# EasyEDA Pro project PT32S038x-Demo.eprj, schematic DEMOPT32x038x Development Kit 1.0

## Sheets
1 Debug: Create Date: 2023-02-03; Page Name: Debug; Project Name: PT32S038x-Demo; Schematic Name: DEMOPT32x038x Development Kit 1.0; Update Date: 2023-02-23; Company: 嘉立创EDA; Page Size: A3; Version: V1.0
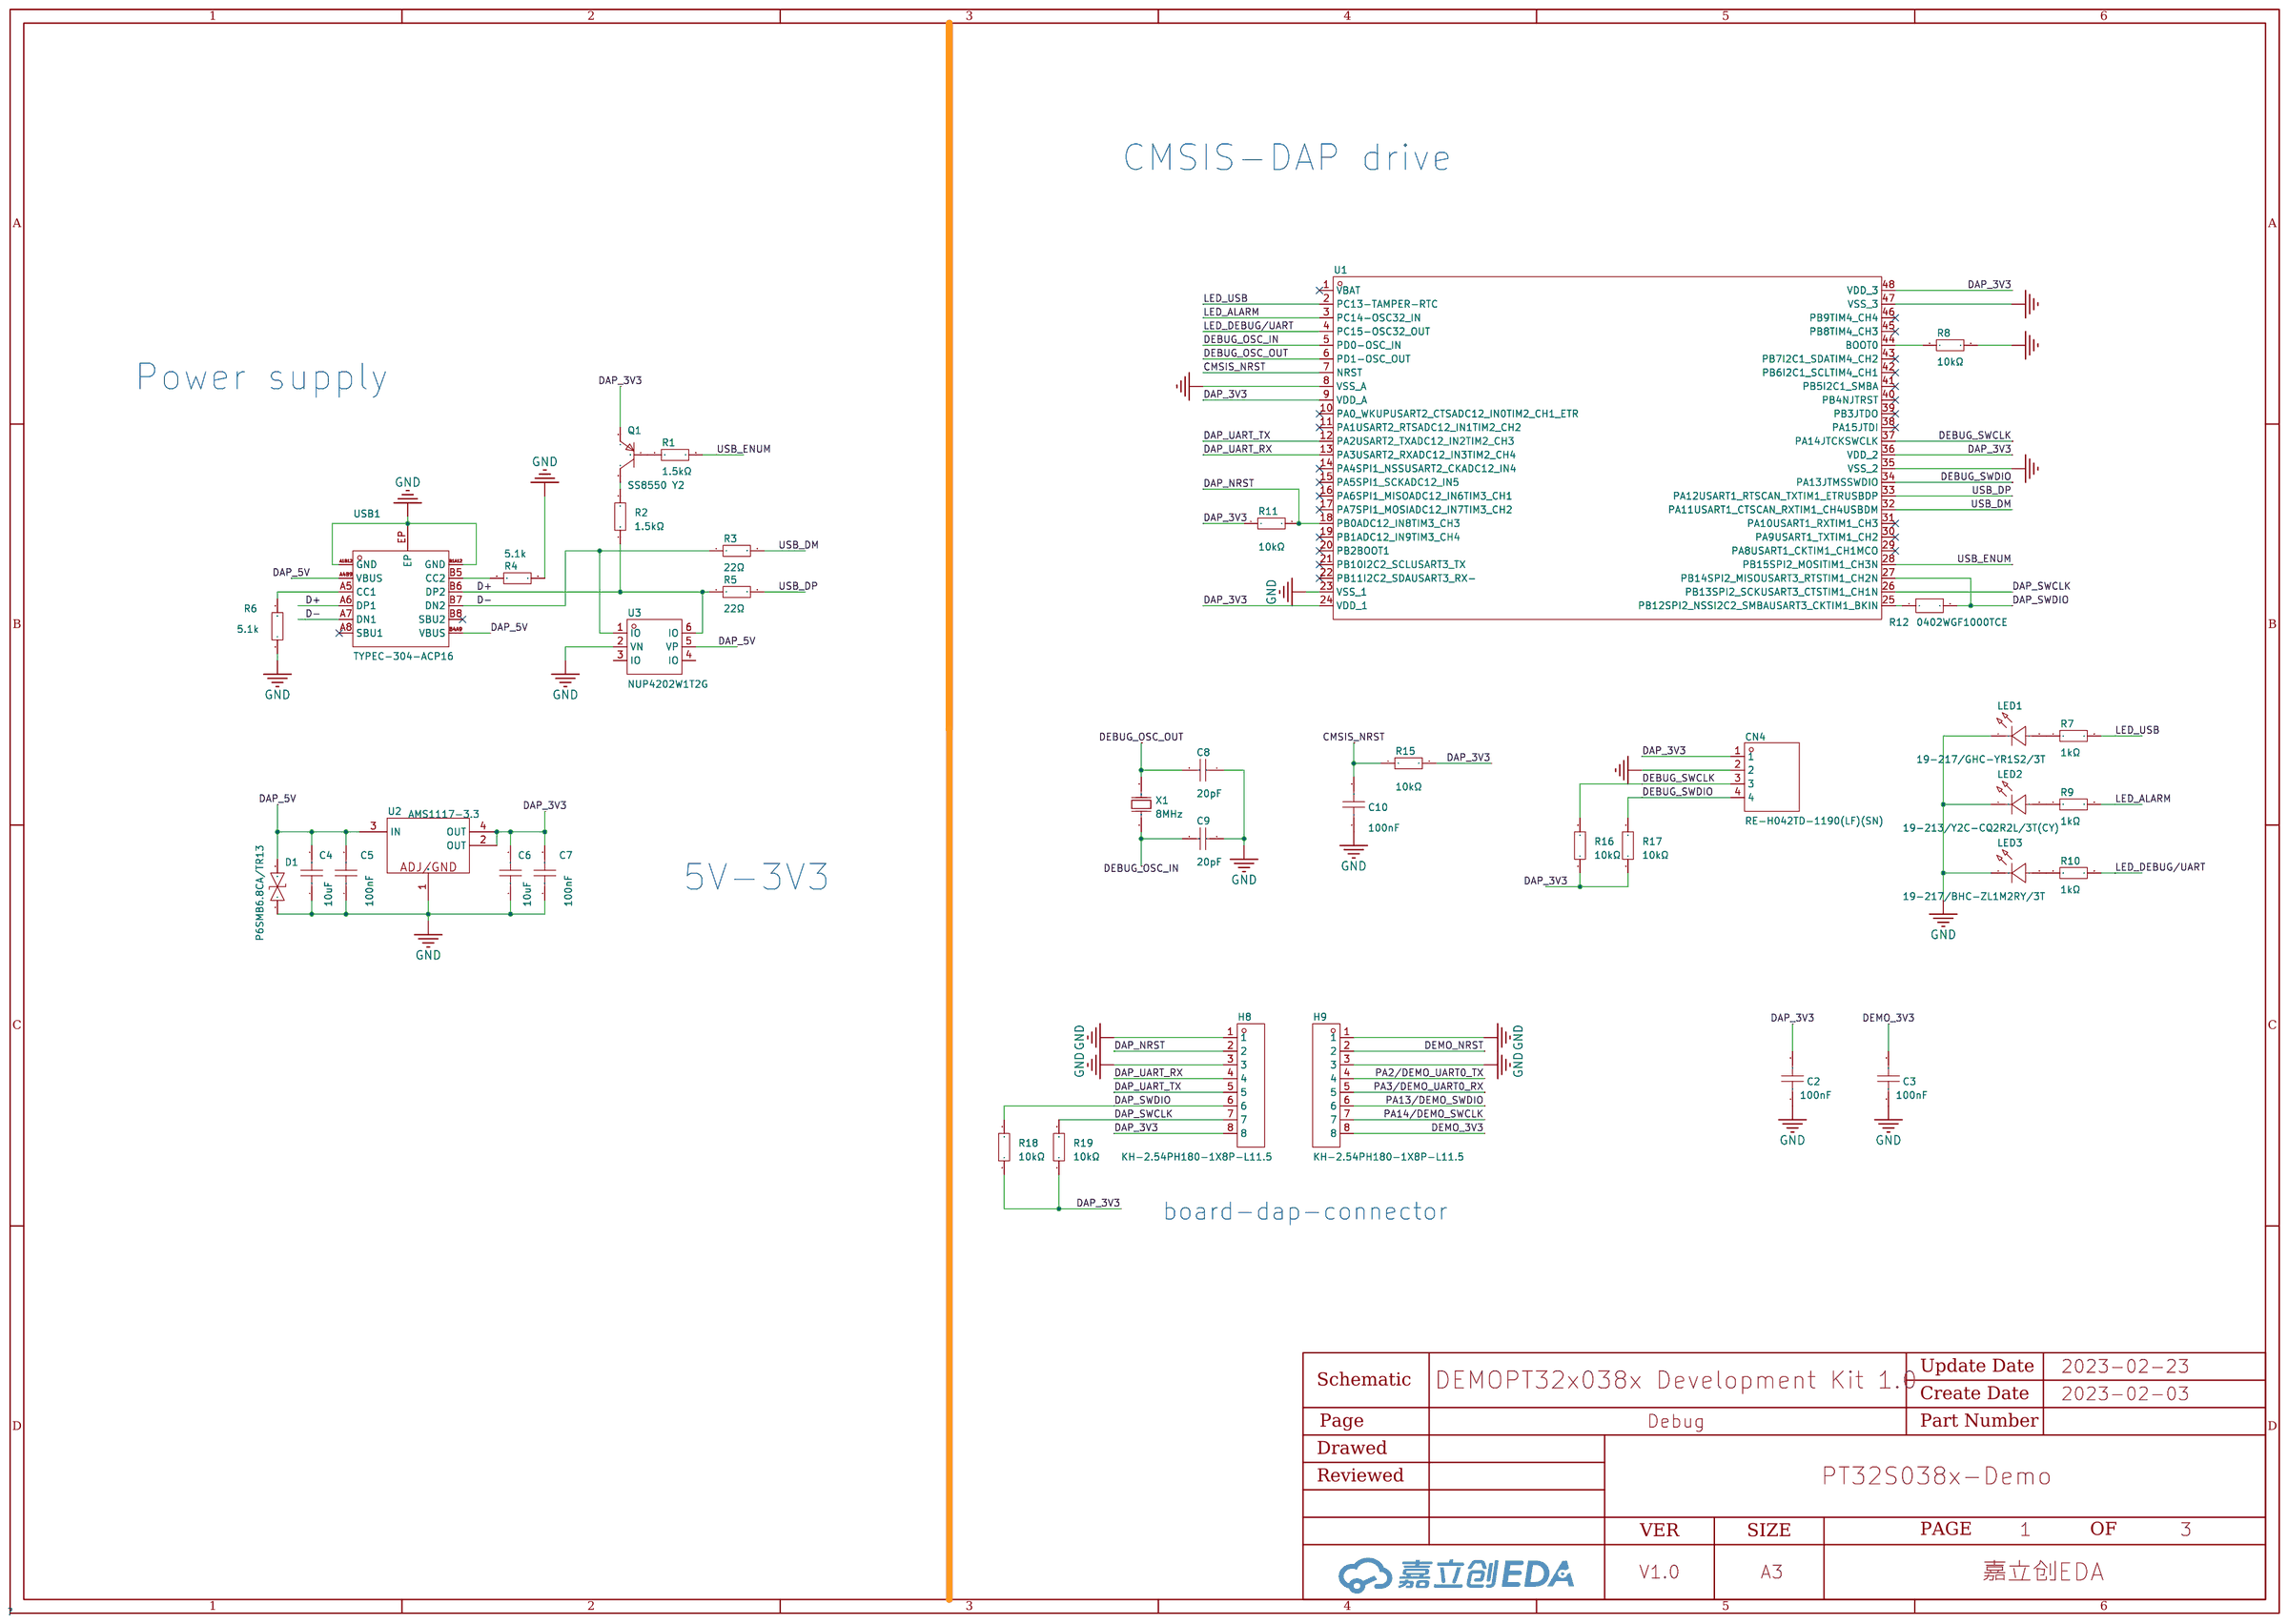
[diagram p0: Debug]
2 MCU: Page Name: MCU
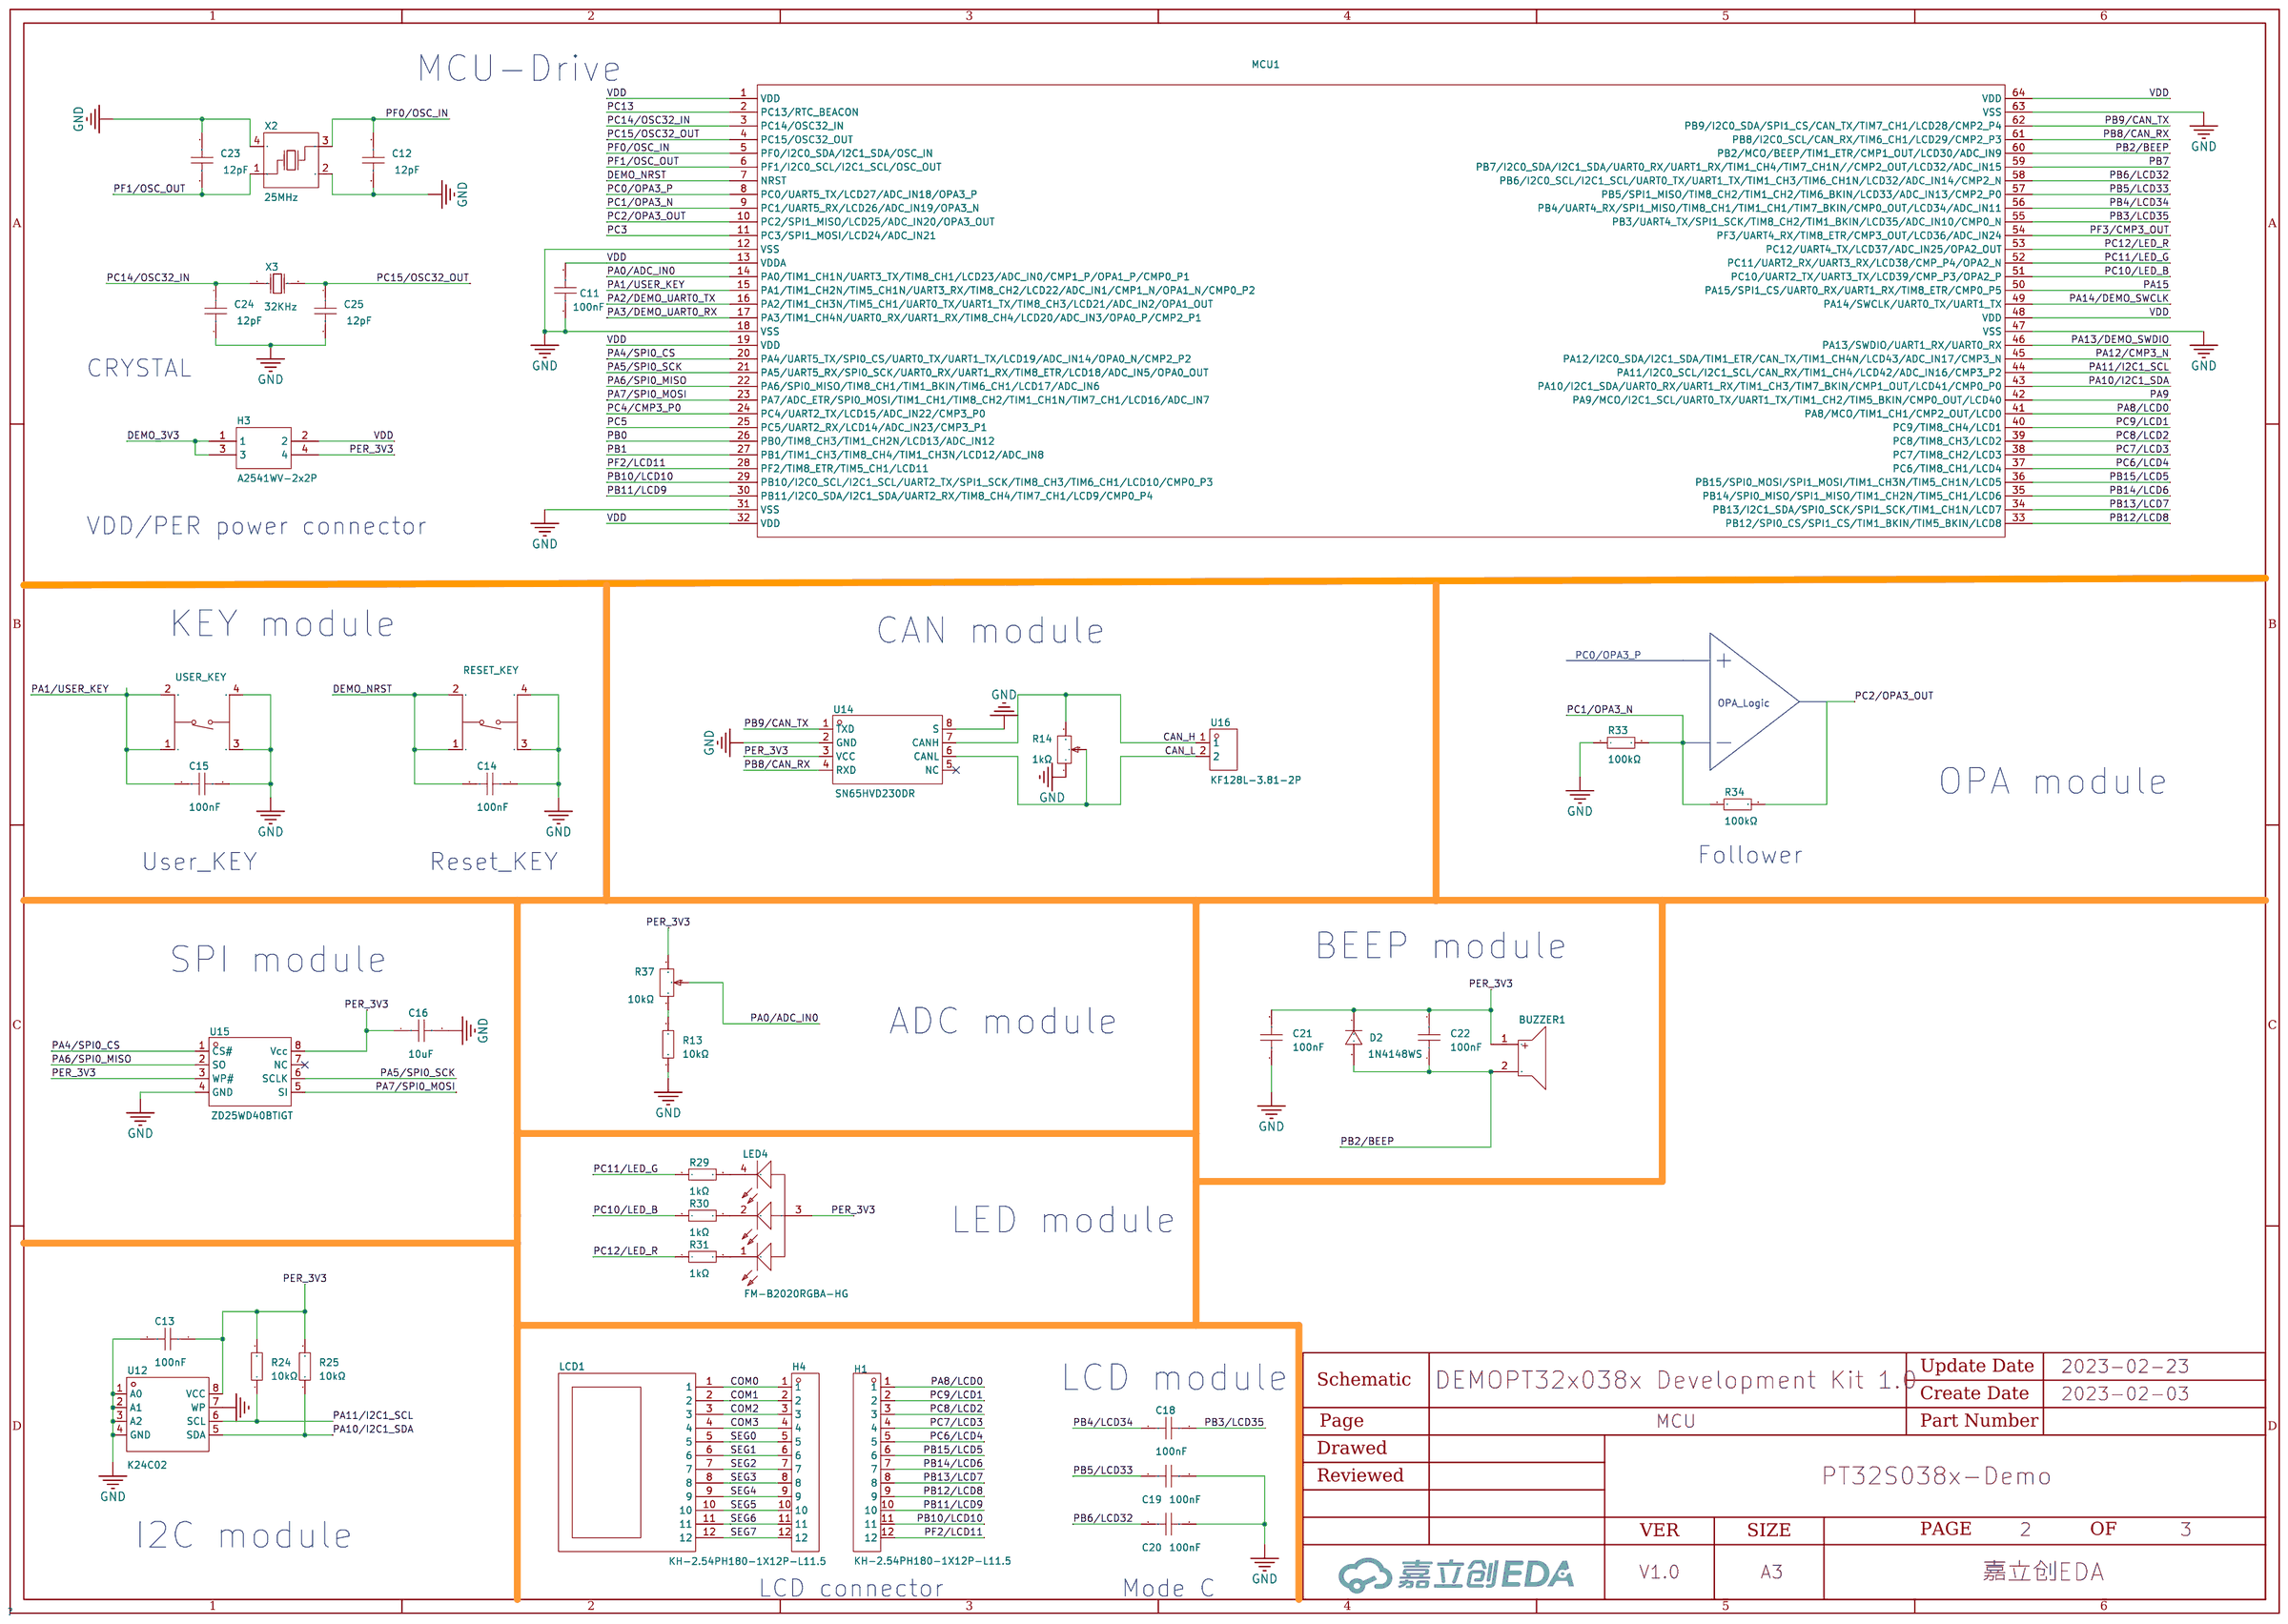
[diagram p1: MCU]
3 Other: Page Name: Other; Update Date: 2023-02-16
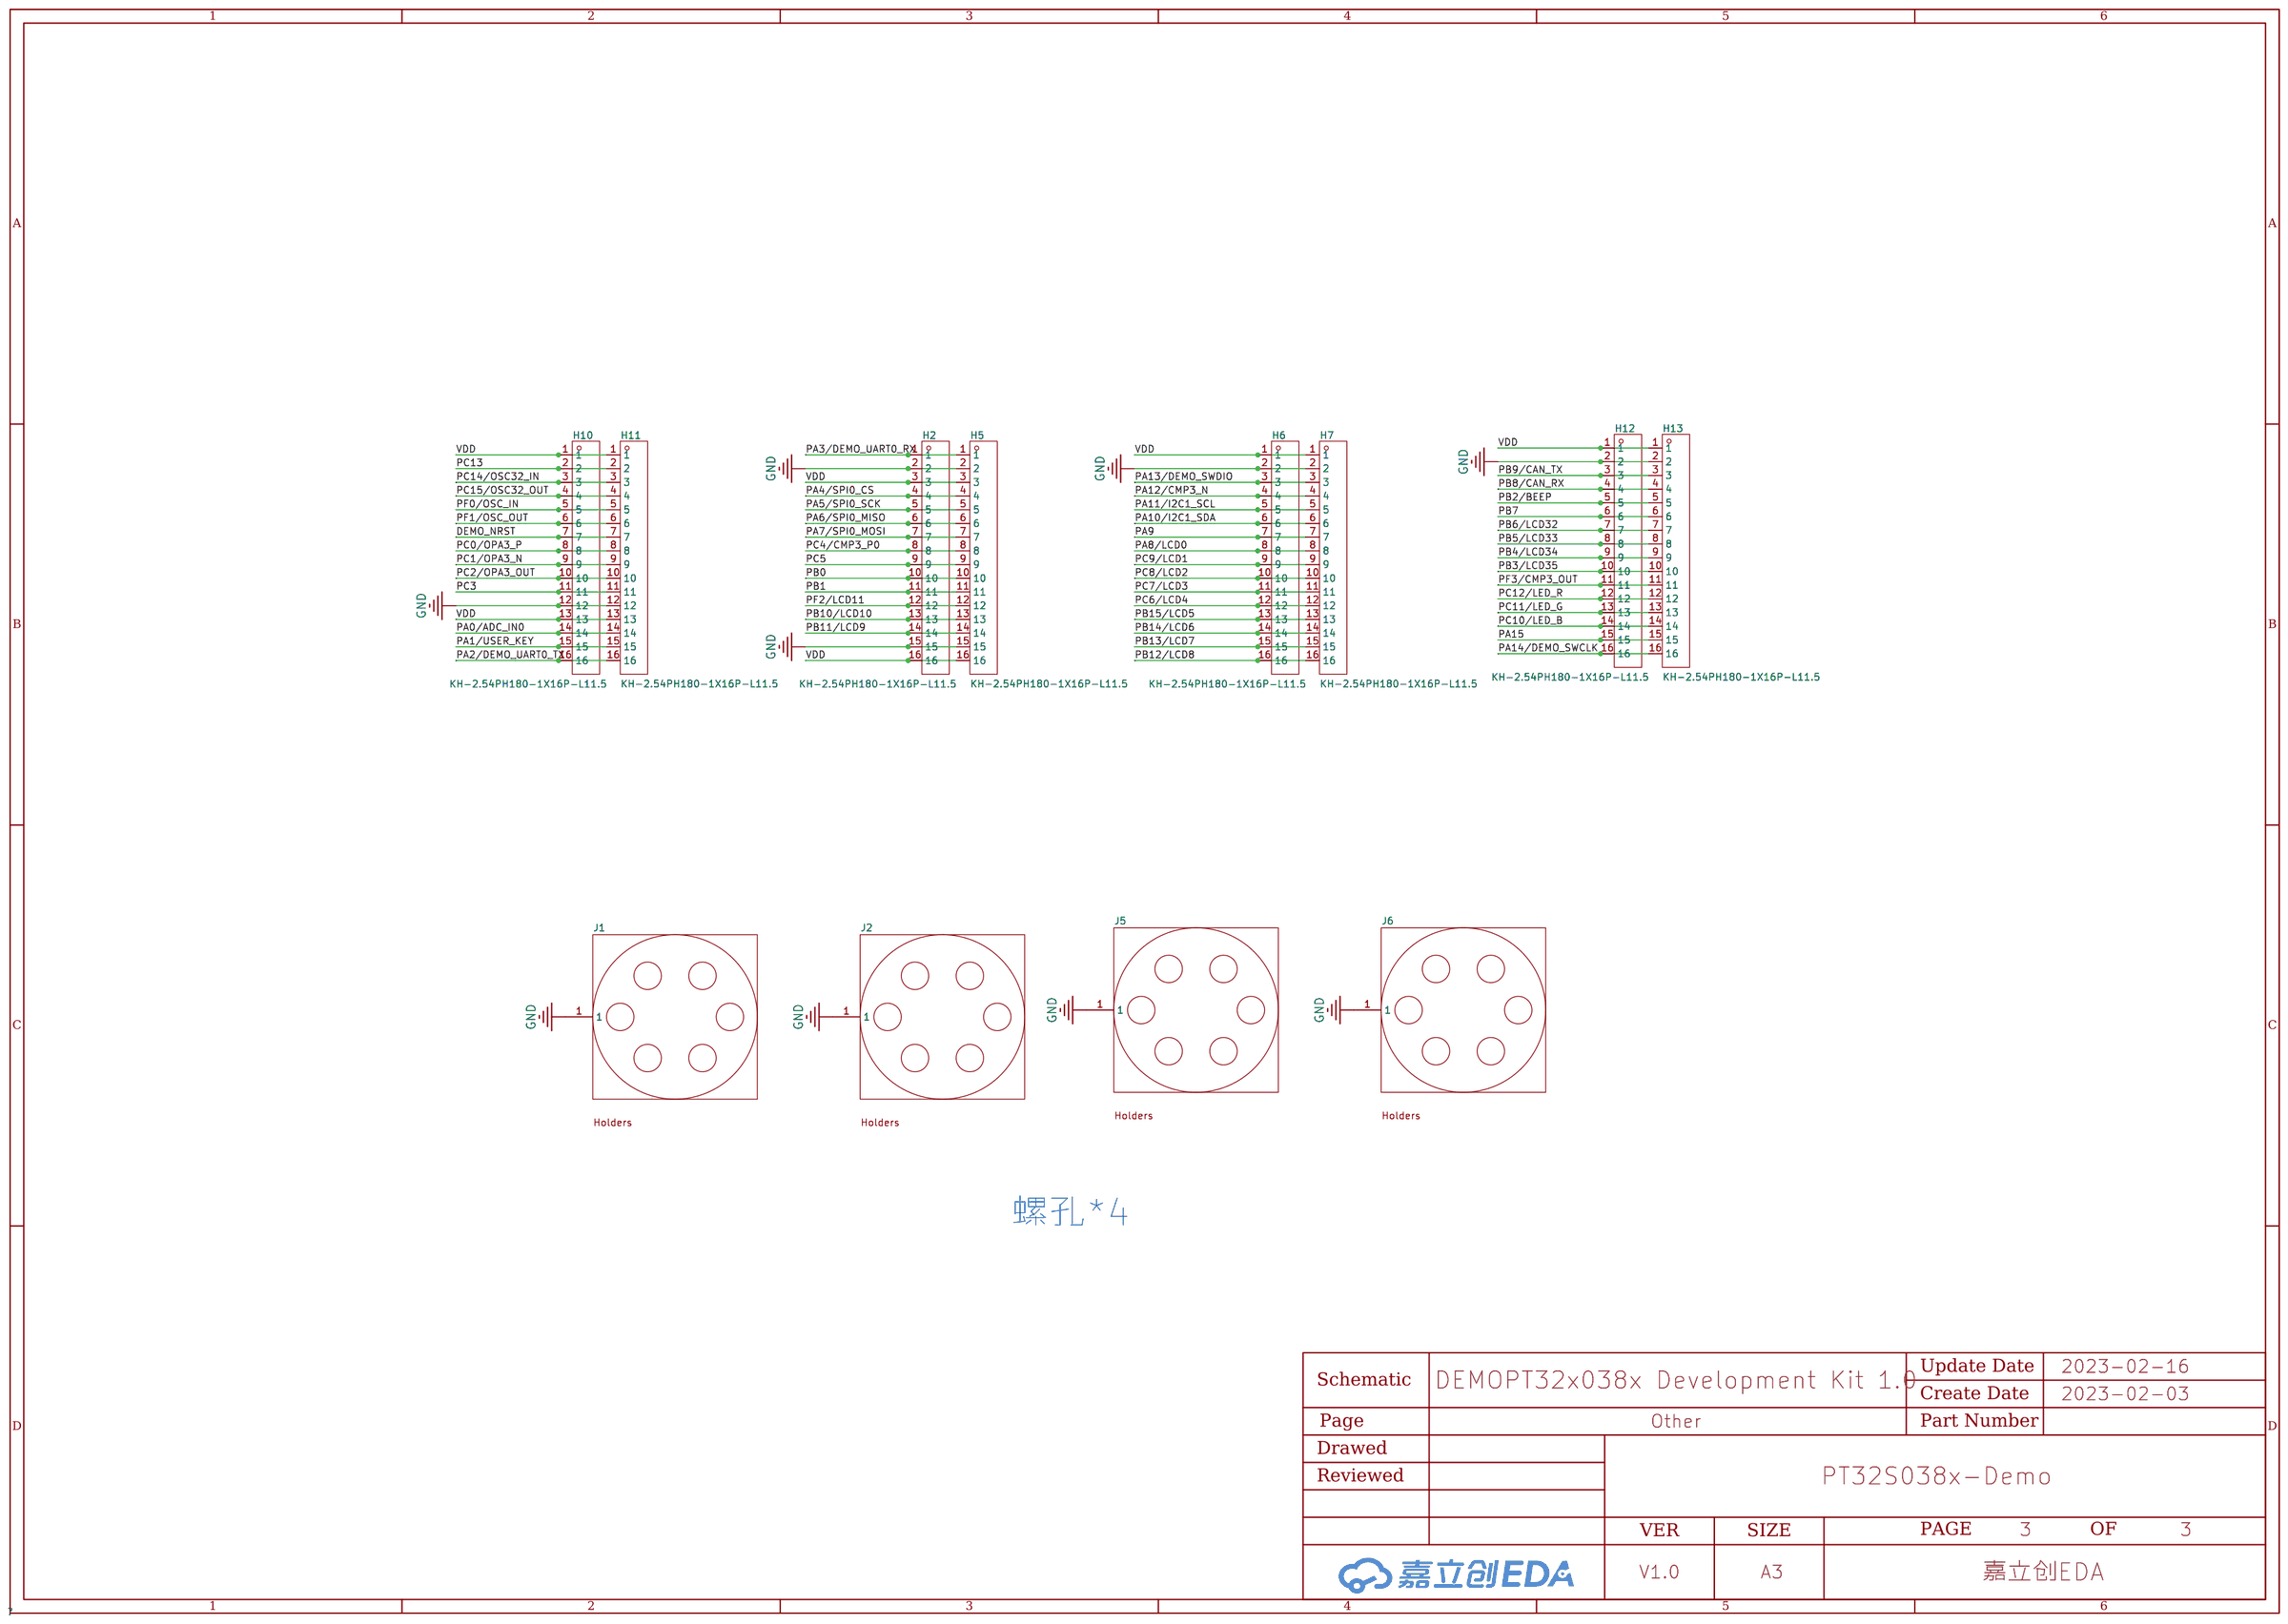
[diagram p2: Other]

## Parts
sheet Debug
C2  100nF  [C0402]
C3  100nF  [C0402]
C4  10uF  [C1206]
C5  100nF  [C0402]
C6  10uF  [C1206]
C7  100nF  [C0402]
C8  20pF  [C0402]
C9  20pF  [C0402]
C10  100nF  [C0402]
CN4  RE-H042TD-1190(LF)(SN)  [HDR-TH_4P-P2.54-V_RE-H042TD-1190]
D1  P6SMB6.8CA/TR13  [SMB_L4.6-W3.6-LS5.3-BI]
H8  KH-2.54PH180-1X8P-L11.5  [HDR-TH_8P-P2.54-V-M]
H9  KH-2.54PH180-1X8P-L11.5  [HDR-TH_8P-P2.54-V-M]
LED1  19-217/GHC-YR1S2/3T  [LED0603-RD]
LED2  19-213/Y2C-CQ2R2L/3T(CY)  [LED0603-RD]
LED3  19-217/BHC-ZL1M2RY/3T  [LED0603-RD]
Q1  SS8550 Y2  [SOT-23-3_L2.9-W1.3-P1.90-LS2.4-BR]
R1  1.5kΩ  [R0402]
R2  1.5kΩ  [R0402]
R3  22Ω  [R0402]
R4  5.1kΩ  [R0402]
R5  22Ω  [R0402]
R6  5.1kΩ  [R0402]
R7  1kΩ  [R0402]
R8  10kΩ  [R0402]
R9  1kΩ  [R0402]
R10  1kΩ  [R0402]
R11  10kΩ  [R0402]
R12  100Ω  [R0402]
R15  10kΩ  [R0402]
R16  10kΩ  [R0402]
R17  10kΩ  [R0402]
R18  10kΩ  [R0402]
R19  10kΩ  [R0402]
U1  STM32F103CBT6  [LQFP-48_L7.0-W7.0-P0.50-LS9.0-BL]
U2  AMS1117-3.3  [SOT-223-3_L6.5-W3.4-P2.30-LS7.0-BR]
U3  NUP4202W1T2G  [SOT-363_L2.0-W1.3-P0.65-LS2.1-BR]
USB1  TYPEC-304-ACP16  [USB-C-SMD_TYPE-C-16P-1]
X1  8MHz  [CRYSTAL-SMD_L5.0-W3.2]
sheet MCU
BUZZER1  2700Hz  [BUZ-TH_BD9.0-P4.00-D0.6-FD]
C11  100nF  [C0402]
C12  12pF  [C0402]
C13  100nF  [C0402]
C14  100nF  [C0402]
C15  100nF  [C0402]
C16  10uF  [C0402]
C18  100nF  [C0402]
C19  100nF  [C0402]
C20  100nF  [C0402]
C21  100nF  [C0402]
C22  100nF  [C0402]
C23  12pF  [C0402]
C24  12pF  [C0402]
C25  12pF  [C0402]
D2  1N4148WS  [SOD-323_L1.8-W1.3-LS2.5-RD]
H1  KH-2.54PH180-1X12P-L11.5  [HDR-TH_12P-P2.54-V-M]
H3  A2541WV-2x2P  [HDR-TH_4P-P2.54-V-R2-C2-S2.54_A2541WV-2X2P]
H4  KH-2.54PH180-1X12P-L11.5  [HDR-TH_12P-P2.54-V-M]
LCD1  -  [LCD_12pin_4com_8seg]
LED4  FM-B2020RGBA-HG  [LED-SMD_FM-B2020RGBA-HG]
MCU1  -  [LQFP-64_L10.0-W10.0-P0.50-LS12.0-BL]
R13  10kΩ  [R0402]
R14  1kΩ  [RES-ADJ-TH_3362P]
R24  10kΩ  [R0402]
R25  10kΩ  [R0402]
R29  1kΩ  [R0402]
R30  1kΩ  [R0402]
R31  1kΩ  [R0402]
R33  100kΩ  [R0402]
R34  100kΩ  [R0402]
R37  10kΩ  [RES-ADJ-TH_3362P]
RESET_KEY  TS-1187A-B-A-B  [SW-SMD_4P-L5.1-W5.1-P3.70-LS6.5-TL-2]
U12  K24C02  [SOIC-8_L4.9-W3.9-P1.27-LS6.0-BL]
U14  SN65HVD230DR  [SOIC-8_L4.9-W3.9-P1.27-LS6.0-BL]
U15  ZD25WD40BTIGT  [SOIC-8_L4.9-W3.9-P1.27-LS6.0-BL]
U16  KF128L-3.81-2P  [CONN-TH_P3.81_KF128L-3.81-2P]
USER_KEY  TS-1187A-B-A-B  [SW-SMD_4P-L5.1-W5.1-P3.70-LS6.5-TL-2]
X2  25MHz  [OSC-SMD_4P-L3.2-W2.5-BL]
X3  32KHz  [OSC-SMD_L3.2-W1.5]
sheet Other
H2  KH-2.54PH180-1X16P-L11.5  [HDR-TH_16P-P2.54-V-M]
H5  KH-2.54PH180-1X16P-L11.5  [HDR-TH_16P-P2.54-V-M]
H6  KH-2.54PH180-1X16P-L11.5  [HDR-TH_16P-P2.54-V-M]
H7  KH-2.54PH180-1X16P-L11.5  [HDR-TH_16P-P2.54-V-M]
H10  KH-2.54PH180-1X16P-L11.5  [HDR-TH_16P-P2.54-V-M]
H11  KH-2.54PH180-1X16P-L11.5  [HDR-TH_16P-P2.54-V-M]
H12  KH-2.54PH180-1X16P-L11.5  [HDR-TH_16P-P2.54-V-M]
H13  KH-2.54PH180-1X16P-L11.5  [HDR-TH_16P-P2.54-V-M]
J1  -  [DEMO板安装孔]
J2  -  [DEMO板安装孔]
J5  -  [DEMO板安装孔]
J6  -  [DEMO板安装孔]

## Library data of the parts
C2 C3 C5 C7 C10 C11 C13-C15 C18-C22 = CL05B104KB54PNC: 容值:100nF;精度:±10%;额定电压:50V;材质(温度系数):X7R;; LCSC Part Name: 100nF ±10% 50V; Supplier Part: C307331; Manufacturer: SAMSUNG(三星); Supplier Footprint: 0402; JLCPCB Part Class: Basic Part; Datasheet: https://atta.szlcsc.com/upload/public/pdf/source/20181009/C307331_222F7C870FD3EA5F46F538B483443886.pdf; Supplier: LCSC; Tolerance: ±10%; Voltage Rated: 50V; Temperature Coefficient: X7R
C4 C6 = CL31A106KBHNNNE: 容值:10uF;精度:±10%;额定电压:50V;材质(温度系数):X5R;; LCSC Part Name: 10uF ±10% 50V; Supplier Part: C13585; Manufacturer: SAMSUNG(三星); Supplier Footprint: 1206; JLCPCB Part Class: Basic Part; Datasheet: https://atta.szlcsc.com/upload/public/pdf/source/20160103/1457707668742.pdf; Supplier: LCSC; Tolerance: ±10%; Voltage Rated: 50V; Temperature Coefficient: X5R
C8 C9 = 0402CG200J500NT: 容值:20pF;精度:±5%;额定电压:50V;材质(温度系数):C0G;; LCSC Part Name: 20pF ±5% 50V; Supplier Part: C1554; Manufacturer: FH(风华); Supplier Footprint: 0402; JLCPCB Part Class: Basic Part; Datasheet: https://atta.szlcsc.com/upload/public/pdf/source/20170923/C1554_1506149268708988361.pdf; Supplier: LCSC; Tolerance: ±5%; Voltage Rated: 50V; Temperature Coefficient: C0G
CN4 = RE-H042TD-1190(LF)(SN): 排数:单排;总PIN位数:4;间距:2.54mm;插针结构:1x4P;行距:-;安装类型:直插;圆针/方针:-;额定电流:-;额定电压:-;配合针长度:6mm;塑高:2.54mm;端接针长度:3mm;触头材质:黄铜;触头镀层:-;工作温度范围:-55℃~+125℃;颜色:黑色;; LCSC Part Name: 2.54mm 1x4P 直插; Supplier Part: C160334; Manufacturer: JST; Supplier Footprint: 直插,P=2.54mm; JLCPCB Part Class: Extended Part; Datasheet: https://atta.szlcsc.com/upload/public/pdf/source/20180420/C160334_6B88A6EA6BFB8B2BA3C08060128C528B.pdf; Supplier: LCSC; Number of Rows: 单排; Number of Pins: 4; Pitch: 2.54mm; Pin Structure: 1x4P; Mounting Type: 直插; Length of Mating Pin: 6mm; Insulation Height: 2.54mm; Length of End Connection Pin: 3mm; Contact Material: 黄铜; Operating Temperature Range: -55℃~+125℃; Color: 黑色
D1 = P6SMB6.8CA/TR13: 极性:双向;反向截止电压(Vrwm):5.8V;击穿电压(最小值):6.45V;峰值脉冲电流(Ipp)@10/1000s:58.1A;最大钳位电压:10.5V;; LCSC Part Name: 双向 Vrwm:5.8V; Supplier Part: C78395; Manufacturer: Brightking(君耀电子); Supplier Footprint: SMB(DO-214AA); JLCPCB Part Class: Basic Part; Datasheet: https://atta.szlcsc.com/upload/public/pdf/source/20160709/1468031879762.pdf; Supplier: LCSC; Polarity: 双向; Reverse Stand-Off Voltage (Vrwm): 5.8V; Breakdown Voltage (Min): 6.45V; Peak Pulse Current (Ipp)@10/1000μs: 58.1A; Maximum Clamping Voltage: 10.5V
H8 H9 = KH-2.54PH180-1X8P-L11.5: 排数:单排;总PIN位数:8;间距:2.54mm;插针结构:1x8P;行距:-;安装类型:直插;圆针/方针:方针;额定电流:3A;额定电压:-;配合针长度:6mm;塑高:2.5mm;端接针长度:3mm;触头材质:-;工作温度范围:-40℃~+105℃;颜色:黑色;; LCSC Part Name: 2.54mm 1x8P 直插 方针; Supplier Part: C2905487; Manufacturer: kinghelm(金航标); Supplier Footprint: 插件,P=2.54mm; JLCPCB Part Class: Extended Part; Datasheet: https://atta.szlcsc.com/upload/public/pdf/source/20211019/E207DA256892DEA6FC546F48FC628120.pdf; Supplier: LCSC; Number of Rows: 单排; Number of Pins: 8; Pitch: 2.54mm; Pin Structure: 1x8P; Mounting Type: 直插; Circluar Pins/Square Pins: 方针; Current Rating (Max): 3A; Length of Mating Pin: 6mm; Insulation Height: 2.5mm; Length of End Connection Pin: 3mm; Operating Temperature Range: -40℃~+105℃; Color: 黑色
LED1 = 19-217/GHC-YR1S2/3T: 发光颜色:翠绿;二极管配置:-;透镜颜色:无色透明;主波长:520nm~535nm;峰值波长:518nm;色温:-;测试电流:20mA;功率:110mW;发光角度:120°;安装方式:-;工作温度:-40℃~+85℃;; LCSC Part Name: 翠绿 520nm~535nm; Supplier Part: C72043; Manufacturer: EVERLIGHT(亿光); Supplier Footprint: 0603; JLCPCB Part Class: Basic Part; Datasheet: https://atta.szlcsc.com/upload/public/pdf/source/20160507/1462613613780.pdf; Supplier: LCSC; Emitted Color: 翠绿; Lens Color: 无色透明; Dominant Wavelength: 520nm~535nm; Peak Wavelength: 518nm; Forward Current: 20mA; Power Dissipation: 110mW; Viewing Angle: 120°; Operating Temperature: -40℃~+85℃
LED2 = 19-213/Y2C-CQ2R2L/3T(CY): 发光颜色:黄灯;二极管配置:-;透镜颜色:无色透明;主波长:585.5nm~591.5nm;峰值波长:591nm;色温:-;测试电流:20mA;功率:60mW;发光角度:120°;安装方式:-;工作温度:-40℃~+85℃;; LCSC Part Name: 黄灯 585.5nm~591.5nm; Supplier Part: C72038; Manufacturer: EVERLIGHT(亿光); Supplier Footprint: 0603; JLCPCB Part Class: Basic Part; Datasheet: https://atta.szlcsc.com/upload/public/pdf/source/20160507/1462613613586.pdf; Supplier: LCSC; Emitted Color: 黄灯; Lens Color: 无色透明; Dominant Wavelength: 585.5nm~591.5nm; Peak Wavelength: 591nm; Forward Current: 20mA; Power Dissipation: 60mW; Viewing Angle: 120°; Operating Temperature: -40℃~+85℃
LED3 = 19-217/BHC-ZL1M2RY/3T: 照明颜色:蓝色;主波长/色坐标:465~475nm;; LCSC Part Name: 0603 蓝灯; Supplier Part: C72041; Manufacturer: EVERLIGHT(亿光); Supplier Footprint: 0603; JLCPCB Part Class: Basic Part; Datasheet: https://atta.szlcsc.com/upload/public/pdf/source/20170116/1484561237273.pdf; Supplier: LCSC; Mounting Type: 表面贴装; Illumination Color: 蓝色; Luminous Intensity (IF=20mA): 11.5~28.5mcd@5mA; Dominant Wavelength / Coordinate rank: 465~475nm; Emitted Color: 翠绿; Forward Current: 5mA; Power Dissipation: 68mW; Viewing Angle: 140°; Mounting Sytle: 正贴
Q1 = SS8550 Y2_C8542: 晶体管类型:PNP;集射极击穿电压(Vceo):25V;集电极电流(Ic):1.5A;功率(Pd):300mW;集电极-发射极饱和电压(VCE(sat)@Ic,Ib):500mV@800mA,80mA;直流电流增益(hFE@Ic,Vce):200@100mA,1V;特征频率(fT):100MHz;工作温度:+150@(Tj);; LCSC Part Name: SS8550 Y2 200-350 Y2 200-350; Supplier Part: C8542; Manufacturer: CJ(江苏长电/长晶); Supplier Footprint: SOT-23(SOT-23-3); JLCPCB Part Class: 基础库; Datasheet: https://atta.szlcsc.com/upload/public/pdf/source/20140809/1457707214734.pdf; Supplier: LCSC; Transistor Type: PNP; Collector-Emitter Breakdown Voltage (Vceo): 25V; Collector Current (Ic): 1.5A; Power Dissipation (Pd): 300mW; Collector-Emitter Saturation Voltage (VCE(sat)@Ic,Ib): 500mV@800mA,80mA; DC Current Gain (hFE@Ic,Vce): 200@100mA,1V; Transition Frequency (fT): 100MHz; Operating Temperature: +150@(Tj)
R1 R2 = 0402WGF1501TCE: 阻值:1.5kΩ;精度:±1%;功率:1/16W;温度系数:±100ppm/℃;最大工作电压:50V;工作温度范围:-55℃~+155℃;; LCSC Part Name: 1.5KΩ ±1%; Supplier Part: C25867; Manufacturer: UNI-ROYAL(厚声); Supplier Footprint: 0402; JLCPCB Part Class: Basic Part; Datasheet: https://atta.szlcsc.com/upload/public/pdf/source/20170920/C25867_1505895090394980874.pdf; Supplier: LCSC; Tolerance: ±1%; Power(Watts): 1/16W; Temperature Coefficient: ±100ppm/℃; Overload Voltage (Max): 50V; Operating Temperature Range: -55℃~+155℃; Type: 薄膜电阻
R3 R5 = 0402WGF220JTCE: LCSC Part Name: 22Ω(22R0) ±1% 编带; Supplier Part: C25092; Manufacturer: UNI-ROYAL(厚声); Supplier Footprint: 0402; JLCPCB Part Class: Basic Part; Datasheet: https://atta.szlcsc.com/upload/public/pdf/source/20170920/C25092_1505901206069982723.pdf; Supplier: LCSC
R4 = 0402WGF5101TCE: 电阻类型:厚膜电阻;阻值:5.1kΩ;精度:±5%;功率:62.5mW;温度系数:±200ppm/℃;工作温度范围:-55℃~+155℃;; LCSC Part Name: 5.1KΩ(5101) ±1% 编带; Supplier Part: C25905; Manufacturer: UNI-ROYAL(厚声); Manufacturer Part: 5.1k; Supplier Footprint: 0402; JLCPCB Part Class: Basic Part; Datasheet: https://atta.szlcsc.com/upload/public/pdf/source/20170920/C25905_1505895107382980911.pdf; Supplier: LCSC; Tolerance: ±5%; Power(Watts): 62.5mW; Temperature Coefficient: ±200ppm/℃; Type: 厚膜电阻; Overload Voltage (Max): 50V; Operating Temperature Range: -55℃~+155℃
R6 = 0402WGF5101TCE: 电阻类型:厚膜电阻;阻值:5.1kΩ;精度:±5%;功率:62.5mW;温度系数:±200ppm/℃;工作温度范围:-55℃~+155℃;; LCSC Part Name: 5.1KΩ(5101) ±1% 编带; Supplier Part: C25905; Manufacturer: UNI-ROYAL(厚声); Manufacturer Part: 5.1k; Supplier Footprint: 0402; JLCPCB Part Class: Basic Part; Datasheet: https://atta.szlcsc.com/upload/public/pdf/source/20170920/C25905_1505895107382980911.pdf; Supplier: LCSC; Tolerance: ±5%; Power(Watts): 62.5mW; Temperature Coefficient: ±200ppm/℃; Type: 厚膜电阻; Operating Temperature Range: -55℃~+155℃
R7 R9 R10 R29-R31 = 0402WGF1001TCE: 电阻类型:厚膜电阻;阻值:1kΩ;精度:±1%;功率:62.5mW;温度系数:±100ppm/℃;最大工作电压:50V;工作温度范围:-55℃~+155℃;; LCSC Part Name: 1kΩ ±1% 62.5mW; Supplier Part: C11702; Manufacturer: UNI-ROYAL(厚声); Supplier Footprint: 0402; JLCPCB Part Class: Basic Part; Datasheet: https://atta.szlcsc.com/upload/public/pdf/source/20200306/C422600_1E6D84923E4A46A82E41ADD87F860B5C.pdf; Supplier: LCSC; Type: 厚膜电阻; Tolerance: ±1%; Power(Watts): 62.5mW; Temperature Coefficient: ±100ppm/℃; Overload Voltage (Max): 50V; Operating Temperature Range: -55℃~+155℃
R8 R11 R13 R15-R19 R24 R25 = 0402WGF1002TCE: 电阻类型:厚膜电阻;阻值:10kΩ;精度:±1%;功率:62.5mW;温度系数:±100ppm/℃;最大工作电压:50V;工作温度范围:-55℃~+155℃;; LCSC Part Name: 10kΩ ±1% 62.5mW; Supplier Part: C25744; Manufacturer: UNI-ROYAL(厚声); Supplier Footprint: 0402; JLCPCB Part Class: Basic Part; Datasheet: https://atta.szlcsc.com/upload/public/pdf/source/20200306/C422600_1E6D84923E4A46A82E41ADD87F860B5C.pdf; Supplier: LCSC; Type: 厚膜电阻; Tolerance: ±1%; Power(Watts): 62.5mW; Temperature Coefficient: ±100ppm/℃; Overload Voltage (Max): 50V; Operating Temperature Range: -55℃~+155℃
R12 = 0402WGF1000TCE: 电阻类型:厚膜电阻;阻值:100Ω;精度:±1%;功率:62.5mW;温度系数:±100ppm/℃;最大工作电压:50V;工作温度范围:-55℃~+155℃;; LCSC Part Name: 100Ω(1000) ±1% 编带; Supplier Part: C25076; Manufacturer: UNI-ROYAL(厚声); Supplier Footprint: 0402; JLCPCB Part Class: Basic Part; Datasheet: https://atta.szlcsc.com/upload/public/pdf/source/20170920/C25076_1505901197574982707.pdf; Supplier: LCSC; Type: 厚膜电阻; Tolerance: ±1%; Power(Watts): 62.5mW; Overload Voltage (Max): 50V; Temperature Coefficient: ±100ppm/℃; Operating Temperature Range: -55℃~+155℃
U1 = STM32F103CBT6: 主频（MAX):72MHz;工作电压:2V ~ 3.6V;; Supplier Part: C8304; Manufacturer: ST(意法半导体); Supplier Footprint: LQFP-48_7x7x05P; JLCPCB Part Class: 扩展库; Datasheet: https://atta.szlcsc.com/upload/public/pdf/source/20140724/1457707170379.pdf; Supplier: LCSC; Speed: 72MHz; Voltage - Supply (Vcc/Vdd): 2V ~ 3.6V; RAM Size: 20KB; Number of I/O: 37; A/D: 16x12bit; PWM: 13; UART/USART: 3 USART; I2C（SMBUS/PMBUS）: 2; USB Device: 1; CAN: 1
U2 = AMS1117-3.3_C6186: 输出类型:固定;输出极性:正;输出通道数:1;最大输入电压:-;输出电压:3.3V;压差:1.3V@(800mA);静态电流(地电流):-;输出电流:1A;电源纹波抑制比(PSRR):72dB@(120Hz);噪声:-;特性:-;工作温度:-;; LCSC Part Name: 正 Vout=3.3V 1A 72dB@(120Hz); Supplier Part: C6186; Manufacturer: AMS; Supplier Footprint: SOT-223-3; JLCPCB Part Class: Basic Part; Datasheet: https://atta.szlcsc.com/upload/public/pdf/source/20180727/C6186_7A095716F0823C02F1997A905E26C086.pdf; Supplier: LCSC; Output Type: 固定; Output Polarity: 正; Number of Outputs: 1; Output Voltage: 3.3V; Dropout Voltage: 1.3V@(800mA); Output Current: 1A; Power Supply Rejection Ratio (PSRR): 72dB@(120Hz)
U3 = NUP4202W1T2G: 极性:-;反向截止电压(Vrwm):5V@Max;击穿电压(最小值):6V;击穿电压(最大值):-;反向漏电流(Ir):-;峰值脉冲电流(Ipp)@10/1000s:-;最大钳位电压:14.5V@Typ;峰值脉冲功率(Ppp)@10/1000s:500W;; LCSC Part Name: Vrwm:5V@Max 500W; Supplier Part: C89319; Manufacturer: onsemi(安森美); Supplier Footprint: SOT-363; JLCPCB Part Class: 扩展库; Datasheet: https://atta.szlcsc.com/upload/public/pdf/source/20170120/1484891298961.PDF; Supplier: LCSC; Reverse Stand-Off Voltage (Vrwm): 5V@Max; Breakdown Voltage (Min): 6V; Maximum Clamping Voltage: 14.5V@Typ; Peak Pulse Power Dissipation (Ppp)@10/1000μs: 500W
USB1 = TYPEC-304-ACP16: 连接器类型:-;标准:-;公母:-;触点数量:-;端口数量:-;安装方式:-;额定电流 - 电源:-;触头材质:-;触头镀层:-;工作温度范围:-;; Supplier Part: C2982555; Manufacturer: XUNPU(讯普); Supplier Footprint: SMD; JLCPCB Part Class: 扩展库; Datasheet: https://atta.szlcsc.com/upload/public/pdf/source/20220311/3C907F75E12F45E4EE7F73565AB9C294.pdf; Supplier: LCSC
X1 = X50328MSB2GI: 晶振类型:贴片无源晶振;频率:8MHz;频率公差:±10ppm;频率稳定度:±50ppm;负载电容:20pF;工作温度:-40℃~+85℃;; LCSC Part Name: YSX530GA 8MHz ±10ppm 20pF; Supplier Part: C115962; Manufacturer: YXC(扬兴晶振); Supplier Footprint: SMD5032-2P; JLCPCB Part Class: Basic Part; Datasheet: https://atta.szlcsc.com/upload/public/pdf/source/20210329/C112559_847D3CACBA33ACCEB57DEA3AEBB187A1.pdf; Supplier: LCSC; Crystal Type: 贴片无源晶振; Frequency Tolerance: ±10ppm; Frequency Stability: ±50ppm; Load Capacitance: 20pF; Operating Temperature: -40℃~+85℃; Equivalent Series Resistance (ESR): 100Ω
BUZZER1 = FS9042-03: 驱动方式:无源(外部驱动);构造类型:电磁式;额定电压:3V;工作电压:2V~4V;频率:2700Hz;声压(SPL):80dB@3V,10cm;直径(φD):9mm;高度:4.4mm;; LCSC Part Name: 电压3V 频率2700Hz 阻抗16Ω; Supplier Part: C482347; Manufacturer: FUET(福声科技); Supplier Footprint: 插件,P=4mm; JLCPCB Part Class: Extended Part; Datasheet: https://atta.szlcsc.com/upload/public/pdf/source/20200113/C482347_CFAB29E7F23AD0BCE8D9A08A7EB3E8CC.pdf; Supplier: LCSC; Oscillator Circuit: 无源(外部驱动); Technology Type: 电磁式; Rated Voltage: 3V; Operating Voltage: 2V~4V; Sound Pressure Level (SPL): 80dB@3V,10cm; Diameter (φD): 9mm; Height: 4.4mm
C12 C23-C25 = 0402CG120J500NT: 容值:12pF;精度:±5%;额定电压:50V;材质(温度系数):C0G;; LCSC Part Name: 12pF ±5% 50V; Supplier Part: C1547; Manufacturer: FH(风华); Supplier Footprint: 0402; JLCPCB Part Class: Basic Part; Datasheet: https://atta.szlcsc.com/upload/public/pdf/source/20170923/C1547_1506149265711988354.pdf; Supplier: LCSC; Tolerance: ±5%; Voltage Rated: 50V; Temperature Coefficient: C0G
C16 = CL05A106MQ5NUNC: 容值:10uF;精度:±20%;额定电压:6.3V;材质(温度系数):X5R;; LCSC Part Name: 10uF ±20% 6.3V; Supplier Part: C15525; Manufacturer: SAMSUNG(三星); Supplier Footprint: 0402; JLCPCB Part Class: Basic Part; Datasheet: https://atta.szlcsc.com/upload/public/pdf/source/20220823/2B02EE04F8F211D38A52DCB16EB6BEBA.pdf; Supplier: LCSC; Tolerance: ±20%; Voltage Rated: 6.3V; Temperature Coefficient: X5R
D2 = 1N4148WS_C2128: 二极管配置:独立式;功率:200mW;直流反向耐压(Vr):100V;平均整流电流(Io):150mA;正向压降(Vf):1.25V@150mA;反向电流(Ir):1uA@75V;反向恢复时间(trr):4ns;工作温度:+150℃@(Tj);; LCSC Part Name: 100V 150mA 4ns T4; Supplier Part: C2128; Manufacturer: CJ(江苏长电/长晶); Supplier Footprint: SOD-323; JLCPCB Part Class: Basic Part; Datasheet: https://atta.szlcsc.com/upload/public/pdf/source/20140809/1457707208178.pdf; Supplier: LCSC; Diode Configuration: 独立式; Power Dissipation: 200mW; Reverse Voltage (Vr): 100V; Average Rectified Current (Io): 150mA; Forward Voltage (Vf@If): 1.25V@150mA; Reverse Leakage Current: 1uA@75V; Reverse Recovery Time (trr): 4ns; Operating Temperature: +150℃@(Tj)
H1 H4 = KH-2.54PH180-1X12P-L11.5: 排数:单排;总PIN位数:12;间距:2.54mm;插针结构:1x12P;行距:-;安装类型:直插;圆针/方针:方针;额定电流:3A;额定电压:-;配合针长度:6mm;塑高:2.5mm;端接针长度:3mm;触头材质:-;工作温度范围:-40℃~+105℃;颜色:黑色;; LCSC Part Name: 2.54mm 1x12P 直插 方针; Supplier Part: C2905489; Manufacturer: kinghelm(金航标); Supplier Footprint: 插件,P=2.54mm; JLCPCB Part Class: Extended Part; Datasheet: https://atta.szlcsc.com/upload/public/pdf/source/20211019/907BE828B313BB62427C82BE2EF837CA.pdf; Supplier: LCSC; Number of Rows: 单排; Number of Pins: 12; Pitch: 2.54mm; Pin Structure: 1x12P; Mounting Type: 直插; Circluar Pins/Square Pins: 方针; Current Rating (Max): 3A; Length of Mating Pin: 6mm; Insulation Height: 2.5mm; Length of End Connection Pin: 3mm; Operating Temperature Range: -40℃~+105℃; Color: 黑色
H3 = A2541WV-2x2P: 排数:双排;总PIN位数:4;间距:2.54mm;插针结构:2x2P;行距:2.54mm;安装类型:直插;圆针/方针:方针;额定电流:-;额定电压:-;配合针长度:6mm;塑高:2.54mm;端接针长度:3mm;触头材质:黄铜;触头镀层:-;工作温度范围:-40℃~+105℃;颜色:黑色;; LCSC Part Name: 2.54mm 2x2P 直插 方针 镀金; Supplier Part: C225517; Manufacturer: CJT(长江连接器); Supplier Footprint: 插件,P=2.54mm; JLCPCB Part Class: Extended Part; Datasheet: https://atta.szlcsc.com/upload/public/pdf/source/20180509/C225517_DBA33AB0BB38BD6C18A60369E3123E24.pdf; Supplier: LCSC; Number of Rows: 双排; Number of Pins: 4; Pitch: 2.54mm; Pin Structure: 2x2P; Row Spacing: 2.54mm; Mounting Type: 直插; Circluar Pins/Square Pins: 方针; Length of Mating Pin: 6mm; Insulation Height: 2.54mm; Length of End Connection Pin: 3mm; Contact Material: 黄铜; Operating Temperature Range: -40℃~+105℃; Color: 黑色
LCD1 = LCD_12pin_4com_8seg: LCD screen with 4COM and 8SEG
LED4 = FM-B2020RGBA-HG: 发光颜色:RGB三色;; LCSC Part Name: RGB三色; Supplier Part: C108793; Manufacturer: 国星光电; Supplier Footprint: SMD,2.1x2.1mm; JLCPCB Part Class: 扩展库; Datasheet: https://atta.szlcsc.com/upload/public/pdf/source/20180518/C108793_2518890ED811E900864AC79152D9E220.pdf; Supplier: LCSC; Emitted Color: RGB三色
MCU1 = PT32S038x: PengPai-Microelectronics Micro control uint
R14 = 3362P-1-102LF: 阻值:1kΩ;精度:±10%;; LCSC Part Name: 1kΩ ±10%; Supplier Part: C58161; Manufacturer: BOURNS; Supplier Footprint: 插件; JLCPCB Part Class: Extended Part; Datasheet: https://atta.szlcsc.com/upload/public/pdf/source/20160823/1471947499746.pdf; Supplier: LCSC; Tolerance: ±10%
R33 R34 = 0402WGF1003TCE: 电阻类型:厚膜电阻;阻值:100kΩ;精度:±1%;功率:62.5mW;温度系数:±100ppm/℃;最大工作电压:50V;工作温度范围:-55℃~+155℃;; LCSC Part Name: 100kΩ ±1% 62.5mW; Supplier Part: C25741; Manufacturer: UNI-ROYAL(厚声); Supplier Footprint: 0402; JLCPCB Part Class: Basic Part; Datasheet: https://atta.szlcsc.com/upload/public/pdf/source/20200306/C422600_1E6D84923E4A46A82E41ADD87F860B5C.pdf; Supplier: LCSC; Type: 厚膜电阻; Tolerance: ±1%; Power(Watts): 62.5mW; Temperature Coefficient: ±100ppm/℃; Overload Voltage (Max): 50V; Operating Temperature Range: -55℃~+155℃
R37 = 3362P-1-103LF: 阻值:10kΩ;精度:±10%;; LCSC Part Name: 10kΩ ±10%; Supplier Part: C58159; Manufacturer: BOURNS; Supplier Footprint: 插件; JLCPCB Part Class: Extended Part; Datasheet: https://atta.szlcsc.com/upload/public/pdf/source/20160823/1471947499549.pdf; Supplier: LCSC; Tolerance: ±10%
RESET_KEY USER_KEY = TS-1187A-B-A-B: 触点电流:50mA;额定电压(DC):12V;绝缘电阻:-;电路结构:单刀单掷;安装方式:立贴;按钮形状:圆形按钮;按钮/盖帽颜色:金色;带灯:无;作用力:160gf;机械寿命:100000;工作温度:-30℃~+85℃;开关长度:5.1mm;开关宽度:5.1mm;开关高度:1.5mm;带支架:否;; LCSC Part Name: 5.1*5.1*1.5 防水金属头160gf; Supplier Part: C318884; Manufacturer: XKB Connectivity(中国星坤); Supplier Footprint: SMD; JLCPCB Part Class: Basic Part; Datasheet: https://atta.szlcsc.com/upload/public/pdf/source/20200227/C318884_1F20165719E1C4CAA3E10C4C359C6E26.pdf; Supplier: LCSC; Contact Current: 50mA; Voltage Rating (DC): 12V; Circuit: 单刀单掷; Mounting Style: 立贴; Actuator Style: 圆形按钮; Actuator/Cap Color: 金色; With Lamp: 无; Operating Force: 160gf; Mechanical Life: 100000; Operating Temperature: -30℃~+85℃; Switch Length: 5.1mm; Switch Width: 5.1mm; Switch Height: 1.5mm; Strike Gundam: 否
U12 = K24C02_C10510: 2-Kbit(256 x 8bit)，I2C接口，工作电压：1.7V to 5.5V; Supplier Part: C10510; Manufacturer: 华虹宏力; Supplier Footprint: SOIC-8_150mil; JLCPCB Part Class: 扩展库; Datasheet: https://atta.szlcsc.com/upload/public/pdf/source/20170116/1484561232223.pdf; Supplier: LCSC
U14 = SN65HVD230DR: 类型:收发器;数据速率:1Mbps;电源电压(Vcc):3V~3.6V;; Supplier Part: C12084; Manufacturer: TI(德州仪器); Supplier Footprint: SOIC-8; JLCPCB Part Class: Basic Part; Datasheet: https://atta.szlcsc.com/upload/public/pdf/source/20140508/1457707055452.pdf; Supplier: LCSC; Type: 收发器; Data Rate: 1Mbps; Supply Voltage: 3V~3.6V
U15 = ZD25WD40BTIGT: SPI NOR Flash，4Mb，2.3-3.6V，SOP8-150，Tube; LCSC Part Name: ZD25WD40; Supplier Part: C969902; Manufacturer: Zetta(澜智); Supplier Footprint: SOIC-8; JLCPCB Part Class: Extended Part; Datasheet: https://atta.szlcsc.com/upload/public/pdf/source/20220331/3CEDB831E4145EB9DF52682CFC7C9ECF.pdf; Supplier: LCSC
U16 = KF128L-3.81-2P: 间距:3.81mm;排数:1;每排PIN数:2;安装方式:直针;额定电流:10A;额定电压:300V;线规 - AWG:16~26;线规 - mm2:1;工作温度范围:-40℃~+105℃;颜色:绿色;; LCSC Part Name: 3.81mm 排数:1 每排P数:2 直针 可拼接 铜 环保; Supplier Part: C474932; Manufacturer: KEFA(科发); Supplier Footprint: 插件,P=3.81mm; JLCPCB Part Class: Extended Part; Datasheet: https://atta.szlcsc.com/upload/public/pdf/source/20200115/C474932_AED72E2A4D2A184D0C8F2A95C52D50B6.pdf; Supplier: LCSC; Pitch: 3.81mm; Number of Rows: 1; Number of PINs Per Row: 2; Mounting Style: 直针; Current Rating (Max): 10A; Voltage Rating (Max): 300V; Wire Gauge - AWG: 16~26; Wire Gauge - mm2: 1; Operating Temperature Range: -40℃~+105℃; Color: 绿色
X2 = X322525MOB4SI: 晶振类型:贴片无源晶振;频率:25MHz;频率公差:±10ppm;频率稳定度:±30ppm;负载电容:12pF;工作温度:-40~+85;; LCSC Part Name: YSX321SL 25MHz ±10ppm 12pF; Supplier Part: C9006; Manufacturer: YXC(扬兴晶振); Supplier Footprint: SMD3225-4P; JLCPCB Part Class: 基础库; Datasheet: https://atta.szlcsc.com/upload/public/pdf/source/20210329/C112971_1F611BDC486E193C1706F6D8EB5AA189.pdf; Supplier: LCSC; Crystal Type: 贴片无源晶振; Frequency Tolerance: ±10ppm; Frequency Stability: ±30ppm; Load Capacitance: 12pF; Operating Temperature: -40~+85
X3 = DST310S 32.768KHz: 晶振类型:-;频率:-;负载电容:-;工作温度:-;; LCSC Part Name: 32.768KHz 12.5PF 20ppm; Supplier Part: C93232; Manufacturer: KDS(大真空); Supplier Footprint: SMD3215-2P; JLCPCB Part Class: Extended Part; Datasheet: https://atta.szlcsc.com/upload/public/pdf/source/20170919/C93232_1505799689477977622.pdf; Supplier: LCSC
H2 H5-H7 H10-H13 = KH-2.54PH180-1X16P-L11.5: 排数:单排;总PIN位数:16;间距:2.54mm;插针结构:1x16P;行距:-;安装类型:直插;圆针/方针:方针;额定电流:3A;额定电压:-;配合针长度:6mm;塑高:2.5mm;端接针长度:3mm;触头材质:-;工作温度范围:-40℃~+105℃;颜色:黑色;; LCSC Part Name: 2.54mm 1x16P 直插 方针; Supplier Part: C2905491; Manufacturer: kinghelm(金航标); Supplier Footprint: 直插,P=2.54mm; JLCPCB Part Class: Extended Part; Datasheet: https://atta.szlcsc.com/upload/public/pdf/source/20211019/0B04AAAEA732E66331FBDF3E5963EEAF.pdf; Supplier: LCSC; Number of Rows: 单排; Number of Pins: 16; Pitch: 2.54mm; Pin Structure: 1x16P; Mounting Type: 直插; Circluar Pins/Square Pins: 方针; Current Rating (Max): 3A; Length of Mating Pin: 6mm; Insulation Height: 2.5mm; Length of End Connection Pin: 3mm; Operating Temperature Range: -40℃~+105℃; Color: 黑色
J1 J2 J5 J6 = 螺孔_3.1X6MM

## Nets
GND: C2.1 C3.1 C4.1 C5.1 C6.1 C7.1 C8.1 C9.1 C10.1 C11.1 C12.2 C13.2 C14.1 C15.1 C16.2 C19.2 C20.2 C21.1 C23.1 C24.2 C25.2 CN4.2 D1.1 H2.2 H2.15 H5.2 H5.15 H6.2 H7.2 H8.1 H8.3 H9.1 H9.3 H10.12 H11.12 H12.2 H13.2 J1.1 J2.1 J5.1 J6.1 LED1.1(K) LED2.1(K) LED3.1(K) MCU1.12(VSS) MCU1.18(VSS) MCU1.31(VSS) MCU1.47(VSS) MCU1.63(VSS) R4.2 R6.1 R8.2 R13.1 R14.1 R33.1 RESET_KEY.3(C) RESET_KEY.4(D) U1.8(VSS_A) U1.23(VSS_1) U1.35(VSS_2) U1.47(VSS_3) U2.1(ADJ/GND) U3.2(VN) U12.1(A0) U12.2(A1) U12.3(A2) U12.4(GND) U12.7(WP) U14.2(GND) U14.8(S) U15.4(GND) USB1.A1B12(GND) USB1.B1A12(GND) USB1.EP USER_KEY.3(C) USER_KEY.4(D) X2.2(GND) X2.4(GND)
VDD: C11.2 H2.3 H2.16 H3.2 H5.3 H5.16 H6.1 H7.1 H10.1 H10.13 H11.1 H11.13 H12.1 H13.1 MCU1.1(VDD) MCU1.13(VDDA) MCU1.19(VDD) MCU1.32(VDD) MCU1.48(VDD) MCU1.64(VDD)
CAN_H: R14.3 U14.7(CANH) U16.1
CAN_L: R14.2 U14.6(CANL) U16.2
CMSIS_NRST: C10.2 R15.1 U1.7(NRST)
COM0: H4.1 LCD1.1
COM1: H4.2 LCD1.2
COM2: H4.3 LCD1.3
COM3: H4.4 LCD1.4
D+: R2.1 R5.1 U3.6(IO) USB1.A6(DP1) USB1.B6(DP2)
D-: R3.1 U3.1(IO) USB1.A7(DN1) USB1.B7(DN2)
DAP_3V3: C2.2 C6.2 C7.2 CN4.1 H8.8 Q1.2(E) R11.1 R15.2 R16.1 R17.1 R18.1 R19.1 U1.9(VDD_A) U1.24(VDD_1) U1.36(VDD_2) U1.48(VDD_3) U2.2(OUT) U2.4(OUT)
DAP_5V: C4.2 C5.2 D1.2 U2.3(IN) U3.5(VP) USB1.A4B9(VBUS) USB1.B4A9(VBUS)
DAP_NRST: H8.2 R11.2 U1.18(PB0ADC12_IN8TIM3_CH3)
DAP_SWCLK: H8.7 R19.2 U1.26(PB13SPI2_SCKUSART3_CTSTIM1_CH1N)
DAP_SWDIO: H8.6 R12.2 R18.2 U1.27(PB14SPI2_MISOUSART3_RTSTIM1_CH2N)
DAP_UART_RX: H8.4 U1.13(PA3USART2_RXADC12_IN3TIM2_CH4)
DAP_UART_TX: H8.5 U1.12(PA2USART2_TXADC12_IN2TIM2_CH3)
DEBUG_OSC_IN: C9.2 U1.5(PD0-OSC_IN) X1.1(In/Out)
DEBUG_OSC_OUT: C8.2 U1.6(PD1-OSC_OUT) X1.2(Out/In)
DEBUG_SWCLK: CN4.3 R16.2 U1.37(PA14JTCKSWCLK)
DEBUG_SWDIO: CN4.4 R17.2 U1.34(PA13JTMSSWDIO)
DEMO_3V3: C3.2 H3.1 H3.3 H9.8
DEMO_NRST: C14.2 H9.2 H10.7 H11.7 MCU1.7(NRST) RESET_KEY.1(A) RESET_KEY.2(B)
LED_ALARM: R9.2 U1.3(PC14-OSC32_IN)
LED_DEBUG/UART: R10.2 U1.4(PC15-OSC32_OUT)
LED_USB: R7.2 U1.2(PC13-TAMPER-RTC)
PA0/ADC_IN0: H10.14 H11.14 MCU1.14(PA0/TIM1_CH1N/UART3_TX/TIM8_CH1/LCD23/ADC_IN0/CMP1_P/OPA1_P/CMP0_P1) R37.2
PA1/USER_KEY: C15.2 H10.15 H11.15 MCU1.15(PA1/TIM1_CH2N/TIM5_CH1N/UART3_RX/TIM8_CH2/LCD22/ADC_IN1/CMP1_N/OPA1_N/CMP0_P2) USER_KEY.1(A) USER_KEY.2(B)
PA2/DEMO_UART0_TX: H9.4 H10.16 H11.16 MCU1.16(PA2/TIM1_CH3N/TIM5_CH1/UART0_TX/UART1_TX/TIM8_CH3/LCD21/ADC_IN2/OPA1_OUT)
PA3/DEMO_UART0_RX: H2.1 H5.1 H9.5 MCU1.17(PA3/TIM1_CH4N/UART0_RX/UART1_RX/TIM8_CH4/LCD20/ADC_IN3/OPA0_P/CMP2_P1)
PA4/SPI0_CS: H2.4 H5.4 MCU1.20(PA4/UART5_TX/SPI0_CS/UART0_TX/UART1_TX/LCD19/ADC_IN14/OPA0_N/CMP2_P2) U15.1(CS#)
PA5/SPI0_SCK: H2.5 H5.5 MCU1.21(PA5/UART5_RX/SPI0_SCK/UART0_RX/UART1_RX/TIM8_ETR/LCD18/ADC_IN5/OPA0_OUT) U15.6(SCLK)
PA6/SPI0_MISO: H2.6 H5.6 MCU1.22(PA6/SPI0_MISO/TIM8_CH1/TIM1_BKIN/TIM6_CH1/LCD17/ADC_IN6) U15.2(SO)
PA7/SPI0_MOSI: H2.7 H5.7 MCU1.23(PA7/ADC_ETR/SPI0_MOSI/TIM1_CH1/TIM8_CH2/TIM1_CH1N/TIM7_CH1/LCD16/ADC_IN7) U15.5(SI)
PA8/LCD0: H1.1 H6.8 H7.8 MCU1.41(PA8/MCO/TIM1_CH1/CMP2_OUT/LCD0)
PA9: H6.7 H7.7 MCU1.42(PA9/MCO/I2C1_SCL/UART0_TX/UART1_TX/TIM1_CH2/TIM5_BKIN/CMP0_OUT/LCD40)
PA10/I2C1_SDA: H6.6 H7.6 MCU1.43(PA10/I2C1_SDA/UART0_RX/UART1_RX/TIM1_CH3/TIM7_BKIN/CMP1_OUT/LCD41/CMP0_P0) R25.1 U12.5(SDA)
PA11/I2C1_SCL: H6.5 H7.5 MCU1.44(PA11/I2C0_SCL/I2C1_SCL/CAN_RX/TIM1_CH4/LCD42/ADC_IN16/CMP3_P2) R24.1 U12.6(SCL)
PA12/CMP3_N: H6.4 H7.4 MCU1.45(PA12/I2C0_SDA/I2C1_SDA/TIM1_ETR/CAN_TX/TIM1_CH4N/LCD43/ADC_IN17/CMP3_N)
PA13/DEMO_SWDIO: H6.3 H7.3 H9.6 MCU1.46(PA13/SWDIO/UART1_RX/UART0_RX)
PA14/DEMO_SWCLK: H9.7 H12.16 H13.16 MCU1.49(PA14/SWCLK/UART0_TX/UART1_TX)
PA15: H12.15 H13.15 MCU1.50(PA15/SPI1_CS/UART0_RX/UART1_RX/TIM8_ETR/CMP0_P5)
PB0: H2.10 H5.10 MCU1.26(PB0/TIM8_CH3/TIM1_CH2N/LCD13/ADC_IN12)
PB1: H2.11 H5.11 MCU1.27(PB1/TIM1_CH3/TIM8_CH4/TIM1_CH3N/LCD12/ADC_IN8)
PB2/BEEP: BUZZER1.2 C22.1 D2.2(A) H12.5 H13.5 MCU1.60(PB2/MCO/BEEP/TIM1_ETR/CMP1_OUT/LCD30/ADC_IN9)
PB3/LCD35: C18.2 H12.10 H13.10 MCU1.55(PB3/UART4_TX/SPI1_SCK/TIM8_CH2/TIM1_BKIN/LCD35/ADC_IN10/CMP0_N)
PB4/LCD34: C18.1 H12.9 H13.9 MCU1.56(PB4/UART4_RX/SPI1_MISO/TIM8_CH1/TIM1_CH1/TIM7_BKIN/CMP0_OUT/LCD34/ADC_IN11)
PB5/LCD33: C19.1 H12.8 H13.8 MCU1.57(PB5/SPI1_MISO/TIM8_CH2/TIM1_CH2/TIM6_BKIN/LCD33/ADC_IN13/CMP2_P0)
PB6/LCD32: C20.1 H12.7 H13.7 MCU1.58(PB6/I2C0_SCL/I2C1_SCL/UART0_TX/UART1_TX/TIM1_CH3/TIM6_CH1N/LCD32/ADC_IN14/CMP2_N)
PB7: H12.6 H13.6 MCU1.59(PB7/I2C0_SDA/I2C1_SDA/UART0_RX/UART1_RX/TIM1_CH4/TIM7_CH1N//CMP2_OUT/LCD32/ADC_IN15)
PB8/CAN_RX: H12.4 H13.4 MCU1.61(PB8/I2C0_SCL/CAN_RX/TIM6_CH1/LCD29/CMP2_P3) U14.4(RXD)
PB9/CAN_TX: H12.3 H13.3 MCU1.62(PB9/I2C0_SDA/SPI1_CS/CAN_TX/TIM7_CH1/LCD28/CMP2_P4) U14.1(TXD)
PB10/LCD10: H1.11 H2.13 H5.13 MCU1.29(PB10/I2C0_SCL/I2C1_SCL/UART2_TX/SPI1_SCK/TIM8_CH3/TIM6_CH1/LCD10/CMP0_P3)
PB11/LCD9: H1.10 H2.14 H5.14 MCU1.30(PB11/I2C0_SDA/I2C1_SDA/UART2_RX/TIM8_CH4/TIM7_CH1/LCD9/CMP0_P4)
PB12/LCD8: H1.9 H6.16 H7.16 MCU1.33(PB12/SPI0_CS/SPI1_CS/TIM1_BKIN/TIM5_BKIN/LCD8)
PB13/LCD7: H1.8 H6.15 H7.15 MCU1.34(PB13/I2C1_SDA/SPI0_SCK/SPI1_SCK/TIM1_CH1N/LCD7)
PB14/LCD6: H1.7 H6.14 H7.14 MCU1.35(PB14/SPI0_MISO/SPI1_MISO/TIM1_CH2N/TIM5_CH1/LCD6)
PB15/LCD5: H1.6 H6.13 H7.13 MCU1.36(PB15/SPI0_MOSI/SPI1_MOSI/TIM1_CH3N/TIM5_CH1N/LCD5)
PC0/OPA3_P: H10.8 H11.8 MCU1.8(PC0/UART5_TX/LCD27/ADC_IN18/OPA3_P)
PC1/OPA3_N: H10.9 H11.9 MCU1.9(PC1/UART5_RX/LCD26/ADC_IN19/OPA3_N) R33.2 R34.1
PC2/OPA3_OUT: H10.10 H11.10 MCU1.10(PC2/SPI1_MISO/LCD25/ADC_IN20/OPA3_OUT) R34.2
PC3: H10.11 H11.11 MCU1.11(PC3/SPI1_MOSI/LCD24/ADC_IN21)
PC4/CMP3_P0: H2.8 H5.8 MCU1.24(PC4/UART2_TX/LCD15/ADC_IN22/CMP3_P0)
PC5: H2.9 H5.9 MCU1.25(PC5/UART2_RX/LCD14/ADC_IN23/CMP3_P1)
PC6/LCD4: H1.5 H6.12 H7.12 MCU1.37(PC6/TIM8_CH1/LCD4)
PC7/LCD3: H1.4 H6.11 H7.11 MCU1.38(PC7/TIM8_CH2/LCD3)
PC8/LCD2: H1.3 H6.10 H7.10 MCU1.39(PC8/TIM8_CH3/LCD2)
PC9/LCD1: H1.2 H6.9 H7.9 MCU1.40(PC9/TIM8_CH4/LCD1)
PC10/LED_B: H12.14 H13.14 MCU1.51(PC10/UART2_TX/UART3_TX/LCD39/CMP_P3/OPA2_P) R30.1
PC11/LED_G: H12.13 H13.13 MCU1.52(PC11/UART2_RX/UART3_RX/LCD38/CMP_P4/OPA2_N) R29.1
PC12/LED_R: H12.12 H13.12 MCU1.53(PC12/UART4_TX/LCD37/ADC_IN25/OPA2_OUT) R31.1
PC13: H10.2 H11.2 MCU1.2(PC13/RTC_BEACON)
PC14/OSC32_IN: C24.1 H10.3 H11.3 MCU1.3(PC14/OSC32_IN) X3.1(OSC1)
PC15/OSC32_OUT: C25.1 H10.4 H11.4 MCU1.4(PC15/OSC32_OUT) X3.2(OSC2)
PER_3V3: BUZZER1.1 C13.1 C16.1 C21.2 C22.2 D2.1(C) H3.4 LED4.3(A) R24.2 R25.2 R37.3 U12.8(VCC) U14.3(VCC) U15.3(WP#) U15.8(Vcc)
PF0/OSC_IN: C12.1 H10.5 H11.5 MCU1.5(PF0/I2C0_SDA/I2C1_SDA/OSC_IN) X2.3(OSC2)
PF1/OSC_OUT: C23.2 H10.6 H11.6 MCU1.6(PF1/I2C0_SCL/I2C1_SCL/OSC_OUT) X2.1(OSC1)
PF2/LCD11: H1.12 H2.12 H5.12 MCU1.28(PF2/TIM8_ETR/TIM5_CH1/LCD11)
PF3/CMP3_OUT: H12.11 H13.11 MCU1.54(PF3/UART4_RX/TIM8_ETR/CMP3_OUT/LCD36/ADC_IN24)
SEG0: H4.5 LCD1.5
SEG1: H4.6 LCD1.6
SEG2: H4.7 LCD1.7
SEG3: H4.8 LCD1.8
SEG4: H4.9 LCD1.9
SEG5: H4.10 LCD1.10
SEG6: H4.11 LCD1.11
SEG7: H4.12 LCD1.12
USB_DM: R3.2 U1.32(PA11USART1_CTSCAN_RXTIM1_CH4USBDM)
USB_DP: R5.2 U1.33(PA12USART1_RTSCAN_TXTIM1_ETRUSBDP)
USB_ENUM: R1.2 U1.28(PB15SPI2_MOSITIM1_CH3N)
$1N1624: R4.1 USB1.B5(CC2)
$1N1626: R6.2 USB1.A5(CC1)
$1N1634: Q1.3(C) R2.2
$1N1635: Q1.1(B) R1.1
$1N3630: R12.1 U1.25(PB12SPI2_NSSI2C2_SMBAUSART3_CKTIM1_BKIN)
$1N3648: R8.1 U1.44(BOOT0)
$1N50133: LED1.2(A) R7.1
$1N50272: LED2.2(A) R9.1
$1N50411: LED3.2(A) R10.1
$2N17159: LED4.4(K) R29.2
$2N17293: LED4.2(K) R30.2
$2N17427: LED4.1(K) R31.2
$2N53882: R13.2 R37.1

Not connected (* = marked no-connect by the designer): U1 1(VBAT)* 10(PA0_WKUPUSART2_CTSADC12_IN0TIM2_CH1_ETR)* 11(PA1USART2_RTSADC12_IN1TIM2_CH2)* 14(PA4SPI1_NSSUSART2_CKADC12_IN4)* 15(PA5SPI1_SCKADC12_IN5)* 16(PA6SPI1_MISOADC12_IN6TIM3_CH1)* 17(PA7SPI1_MOSIADC12_IN7TIM3_CH2)* 19(PB1ADC12_IN9TIM3_CH4)* 20(PB2BOOT1)* 21(PB10I2C2_SCLUSART3_TX)* 22(PB11I2C2_SDAUSART3_RX-)* 29(PA8USART1_CKTIM1_CH1MCO)* 30(PA9USART1_TXTIM1_CH2)* 31(PA10USART1_RXTIM1_CH3)* 38(PA15JTDI)* 39(PB3JTDO)* 40(PB4NJTRST)* 41(PB5I2C1_SMBA)* 42(PB6I2C1_SCLTIM4_CH1)* 43(PB7I2C1_SDATIM4_CH2)* 45(PB8TIM4_CH3)* 46(PB9TIM4_CH4)*; U3 3(IO) 4(IO); U14 5(NC)*; U15 7(NC)*; USB1 A8(SBU1)* B8(SBU2)*

## Notes on the sheets
sheet 1
- CMSIS-DAP drive
- Power supply
- 5V-3V3
- board-dap-connector
sheet 2
- MCU-Drive
- CRYSTAL
- VDD/PER power connector
- KEY module
- CAN module
- PC0/OPA3_P
- OPA_Logic
- OPA module
- User_KEY
- Reset_KEY
- Follower
- BEEP module
- SPI module
- ADC module
- LED module
- LCD module
- I2C module
- LCD connector
- Mode C
sheet 3
- 螺孔*4
